# EAGLE design demulplx (EAGLE 9.0.1)
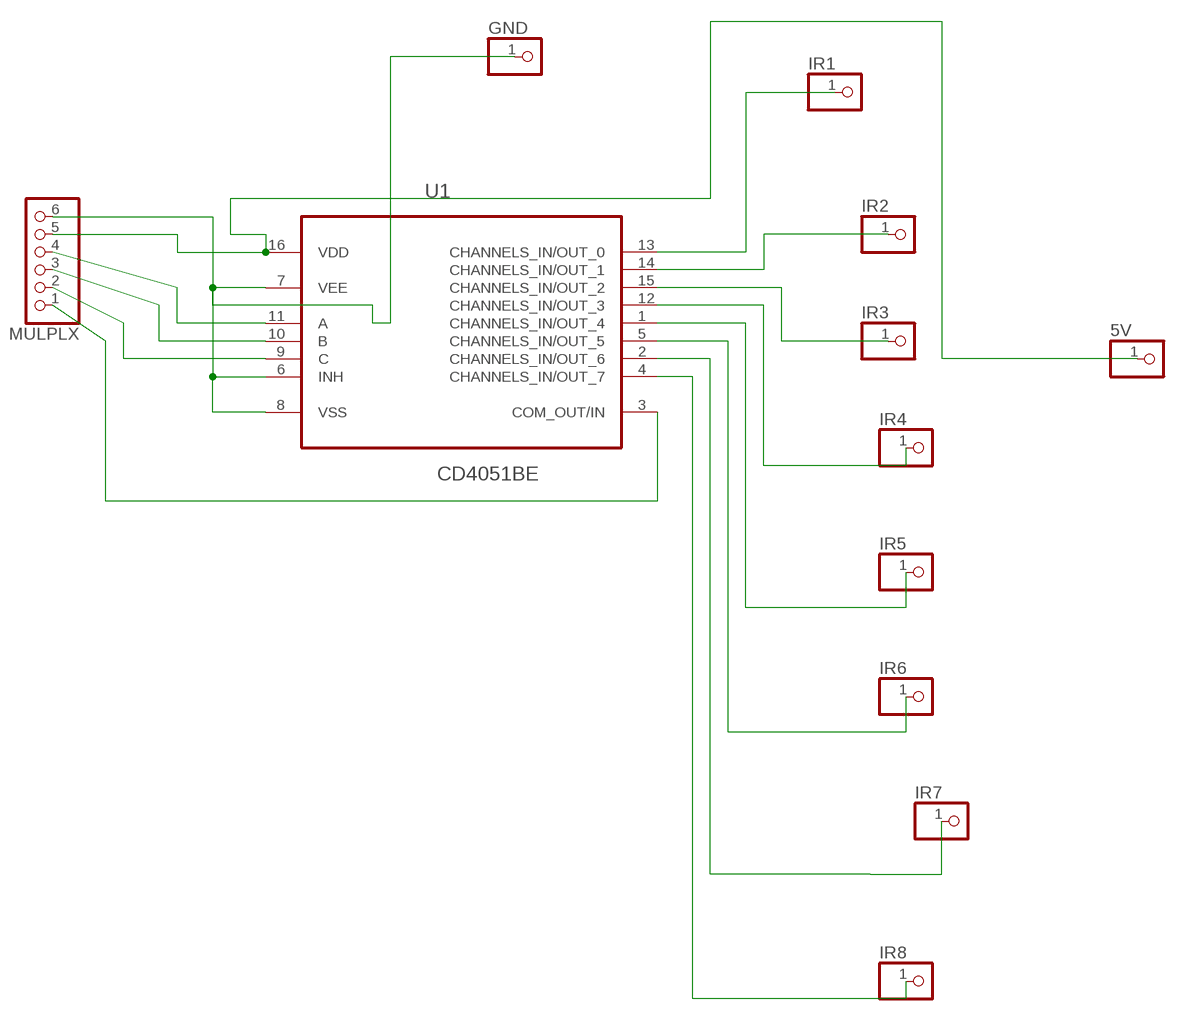
[diagram p0: schematic, sheet 1]

## Parts
5V  PINHD-1X01_2.54  [1X01]
GND  PINHD-1X01_2.54  [1X01]
IR1  PINHD-1X01_2.54  [1X01]
IR2  PINHD-1X01_2.54  [1X01]
IR3  PINHD-1X01_2.54  [1X01]
IR4  PINHD-1X01_2.54  [1X01]
IR5  PINHD-1X01_2.54  [1X01]
IR6  PINHD-1X01_2.54  [1X01]
IR7  PINHD-1X01_2.54  [1X01]
IR8  PINHD-1X01_2.54  [1X01]
MULPLX  PINHD-1X06_2.54-S  [1X06-S]
U1  CD4051BE  [DIP254P762X508-16]

## Nets
5V [supply]: 5V.1 MULPLX.5 U1.16(VDD)
GND [supply]: GND.1 MULPLX.6 U1.6(INH) U1.7(VEE) U1.8(VSS)
N$3: IR7.1 U1.2(CHANNELS_IN/OUT_6)
N$4: IR1.1 U1.13(CHANNELS_IN/OUT_0)
N$5: IR2.1 U1.14(CHANNELS_IN/OUT_1)
N$6: IR3.1 U1.15(CHANNELS_IN/OUT_2)
N$7: IR4.1 U1.12(CHANNELS_IN/OUT_3)
N$8: IR5.1 U1.1(CHANNELS_IN/OUT_4)
N$9: IR6.1 U1.5(CHANNELS_IN/OUT_5)
N$10: IR8.1 U1.4(CHANNELS_IN/OUT_7)
N$11: MULPLX.1 U1.3(COM_OUT/IN)
N$12: MULPLX.4 U1.11(A)
N$13: MULPLX.3 U1.10(B)
N$14: MULPLX.2 U1.9(C)

## Library data of the parts
5V GND IR1-IR8 = pinhead-2:PINHD-1X01: PIN HEADER
MULPLX = pinhead-2:PINHD-1X06: PIN HEADER
U1 = Texas Instruments_By_element14_Batch_1:CD4051BE: The CD4051B is a single 8-Channel multiplexer having three binary control inputs.; MPN: CD4051BE; OC_FARNELL: 1106109; OC_NEWARK: 60K5119; PACKAGE: PDIP-16; SUPPLIER: Texas Instruments

## Net classes
0 default: width 0.457 mm
1 supply: width 0.635 mm

## Board
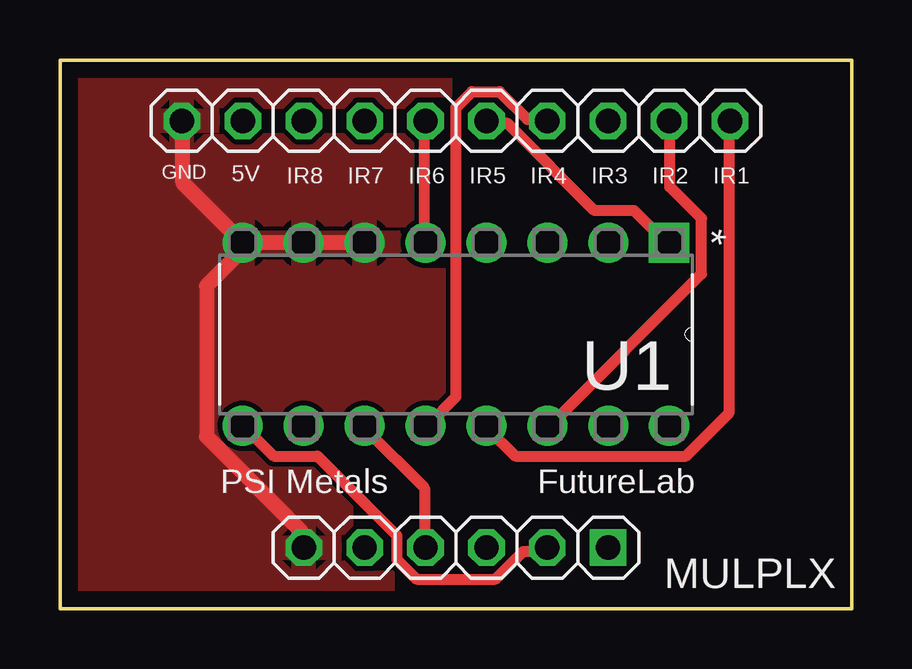
[diagram p1: board, top side]
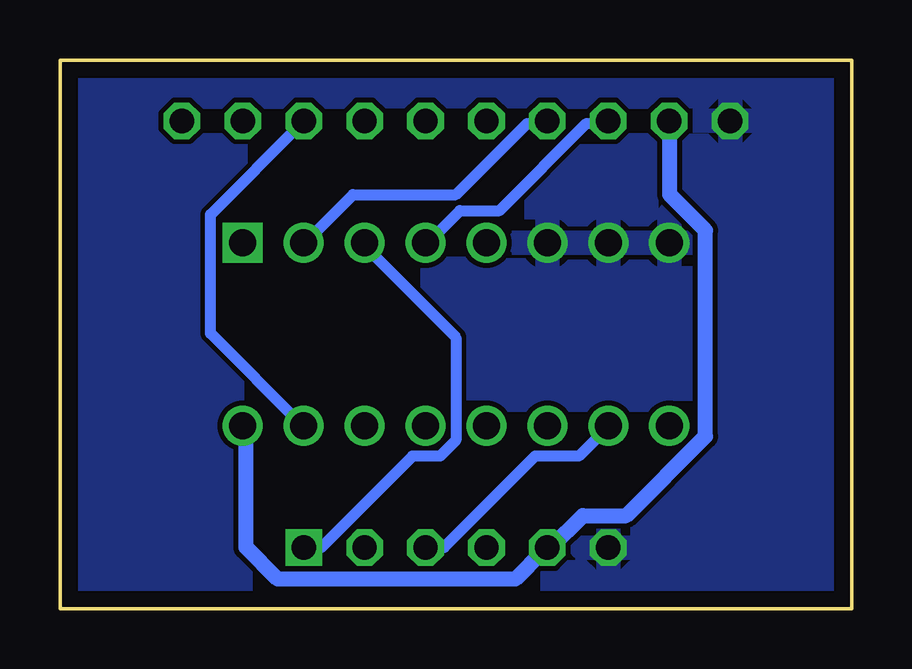
[diagram p2: board, bottom side, seen from below]

Size 33.02 x 22.86 mm. Coordinates in mm from the lower left corner, seen from the top.
Outline: 0,22.86 0,0 33.02,0 33.02,22.86 0,22.86
Copper layers (1*16): Top 0.035mm / dielectric 1.5mm / Bottom 0.035mm
Design rules "default *": minimum track width 18mil, minimum drill 0.35mm, track to track 8mil, track to pad 8mil, pad to pad 8mil, via to via 12mil, smd to smd 6mil, copper to edge 26mil, drill to drill 12mil, minimum pad ring 10mil, minimum via ring 10mil, stop-mask expansion 4mil, vias tented up to drill 15mil, thermal gap 10mil

### Footprints (pad centres in the part's own frame; a part is rotated, then mirrored left to right if it is on the bottom)
1X01 = drill 1.016 octagon: 1 0,0
1X06-S = drill 1.016 square: 1 -6.35,0 | drill 1.016 octagon: 2 -3.81,0; 3 -1.27,0; 4 1.27,0; 5 3.81,0; 6 6.35,0
DIP254P762X508-16 = drill 1.118 square: 1 -7.62,17.78 | drill 1.118: 2 -7.62,15.24; 3 -7.62,12.7; 4 -7.62,10.16; 5 -7.62,7.62; 6 -7.62,5.08; 7 -7.62,2.54; 8 -7.62,0; 9 0,0; 10 0,2.54; 11 0,5.08; 12 0,7.62; 13 0,10.16; 14 0,12.7; 15 0,15.24; 16 0,17.78

### Placement (x,y rotation side)
5V  7.62,20.32 0 top
GND  5.08,20.32 0 top
IR1  27.94,20.32 0 top
IR2  25.4,20.32 0 top
IR3  22.86,20.32 0 top
IR4  20.32,20.32 0 top
IR5  17.78,20.32 0 top
IR6  15.24,20.32 0 top
IR7  12.7,20.32 0 top
IR8  10.16,20.32 0 top
MULPLX  16.51,2.54 180 top
U1  7.62,7.62 270 top

### Tracks (layer width: path | path; a pad name or v marks a point on that pad's centre or on a via)
5V
  Bottom 0.635: 5V.1 7.59,20.22 7.59,17.25 6.11,15.76 6.11,7.18 9.41,3.87 11.23,3.87 12.55,2.55 MULPLX.5 12.88,2.39 14.03,1.23 23.94,1.23 25.26,2.55 25.26,7.51 U1.16
GND
  Top 0.635: U1.8 5.12,17.74 5.12,20.22 GND.1 | MULPLX.6 10.07,2.55 10.07,3.21 6.11,7.18 6.11,13.45 7.59,14.94 U1.8 | U1.8 7.92,15.27 10.07,15.27 U1.7 10.4,15.27 12.55,15.27 U1.6
  pour Bottom: -1.59,25.08 35.24,25.08 35.24,24.77 35.24,-1.59 -1.59,-1.59
  pour Top: -4.13,26.99 37.15,26.99 37.15,-3.17 -3.81,-3.17 -4.13,-3.17
N$3
  Bottom 0.457: IR7.1 12.71,20.22 13.54,20.22 16.51,17.25 20.8,17.25 22.78,15.27 U1.2
N$4
  Top 0.457: IR1.1 27.9,20.22 27.9,8.17 26.09,6.35 18.99,6.35 17.83,7.51 U1.13
N$5
  Top 0.457: IR2.1 25.43,20.22 25.43,17.58 26.75,16.26 26.75,13.94 20.47,7.67 U1.14
N$6
  Bottom 0.457: IR3.1 22.95,20.22 26.75,16.42 26.75,11.47 22.95,7.67 U1.15
N$7
  Top 0.457: IR4.1 20.31,20.38 19.48,20.38 18.33,21.54 17.17,21.54 16.51,20.88 16.51,8.83 15.35,7.67 U1.12
N$8
  Top 0.457: IR5.1 17.83,20.22 18.66,20.22 22.29,16.59 23.94,16.59 25.26,15.27 U1.1
N$9
  Top 0.457: IR6.1 15.19,20.22 15.19,15.27 U1.5
N$10
  Bottom 0.457: IR8.1 10.24,20.22 11.06,20.22 14.69,16.59 16.34,16.59 17.67,15.27 U1.4
N$11
  Bottom 0.457: MULPLX.1 22.78,2.55 22.12,2.55 18.33,6.35 17.17,6.35 16.51,7.01 16.51,11.3 20.31,15.1 U1.3
N$12
  Top 0.457: MULPLX.4 15.19,2.55 15.19,5.03 12.71,7.51 U1.11
N$13
  Bottom 0.457: MULPLX.3 17.67,2.55 17,2.55 13.21,6.35 11.39,6.35 10.24,7.51 U1.10
N$14
  Top 0.457: MULPLX.2 20.31,2.39 19.32,2.39 18.16,1.23 14.86,1.23 14.03,2.06 14.03,3.05 10.73,6.35 8.91,6.35 7.76,7.51 U1.9

### Text on the board
tPlace: PSI Metals | FutureLab